# Altium schematic sheet 01_Connector.SchDoc
size A4
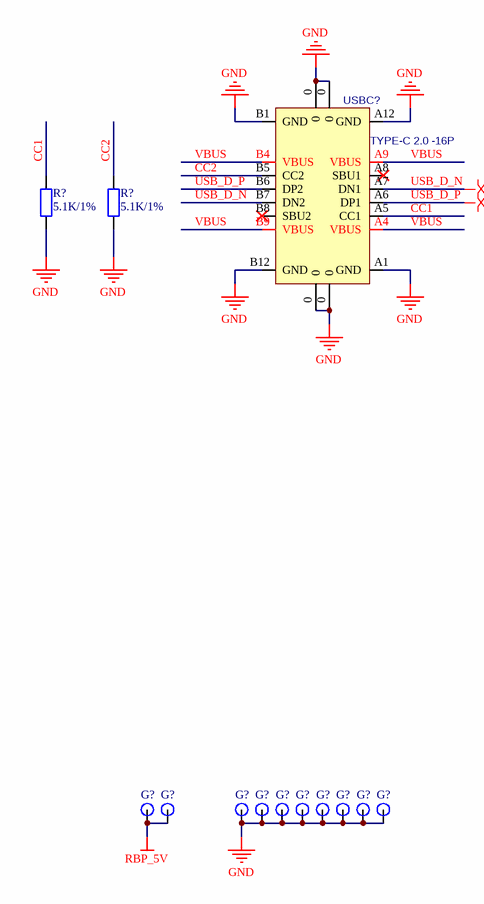
[diagram p0: 01_Connector.SchDoc]

## Parts
(Parts that share a designator on the sheet are numbered #1, #2 ... from top to bottom, then left to right.)
G?#1  RBP_GPIO  [PA100-A3]  (value not drawn)
G?#2  RBP_GPIO  [PA100-A3]  (value not drawn)
G?#3  RBP_GPIO  [PA100-A3]  (value not drawn)
G?#4  RBP_GPIO  [PA100-A3]  (value not drawn)
G?#5  RBP_GPIO  [PA100-A3]  (value not drawn)
G?#6  RBP_GPIO  [PA100-A3]  (value not drawn)
G?#7  RBP_GPIO  [PA100-A3]  (value not drawn)
G?#8  RBP_GPIO  [PA100-A3]  (value not drawn)
G?#9  RBP_GPIO  [PA100-A3]  (value not drawn)
G?#10  RBP_GPIO  [PA100-A3]  (value not drawn)
R?#1  5.1K/1%  [R0402_L]
R?#2  5.1K/1%  [R0402_L]
USBC?  TYPE-C 2.0 -16P  [USB-C-SMD_16P]

## Nets
GND: G?#3.1 G?#4.1 G?#5.1 G?#6.1 G?#7.1 G?#8.1 G?#9.1 G?#10.1 R?#1.1 R?#2.1 USBC?.0 USBC?.A1(GND) USBC?.A12(GND) USBC?.B1(GND) USBC?.B12(GND)
RBP_5V: G?#1.1 G?#2.1
CC1: R?#1.2 USBC?.A5(CC1)
CC2: R?#2.2 USBC?.B5(CC2)
USB_D_N: USBC?.A7(DN1) USBC?.B7(DN2)
USB_D_P: USBC?.A6(DP1) USBC?.B6(DP2)
VBUS: USBC?.A4(VBUS) USBC?.A9(VBUS) USBC?.B4(VBUS) USBC?.B9(VBUS)

Not connected (* = marked no-connect by the designer): USBC? A8(SBU1)* B8(SBU2)*

## Layout directives
differential pair: USB_D_N, USB_D_P

## Library data of the parts
R?#1 R?#2 = R: 贴片电阻; 联系卖家，免费查找封装: 唯一出售店铺网址https://shop463601444.taobao.com; BOM名称: 贴片电阻
USBC? = USB2.0_Type-C_16Pin: USB2.0_Type-C_16Pin母座; 联系卖家 免费查找封装: 唯一出售店铺网址https://shop463601444.taobao.com; 联系卖家 免费技术支持: 封装库来自淘宝卖家ID：黄晶宝石